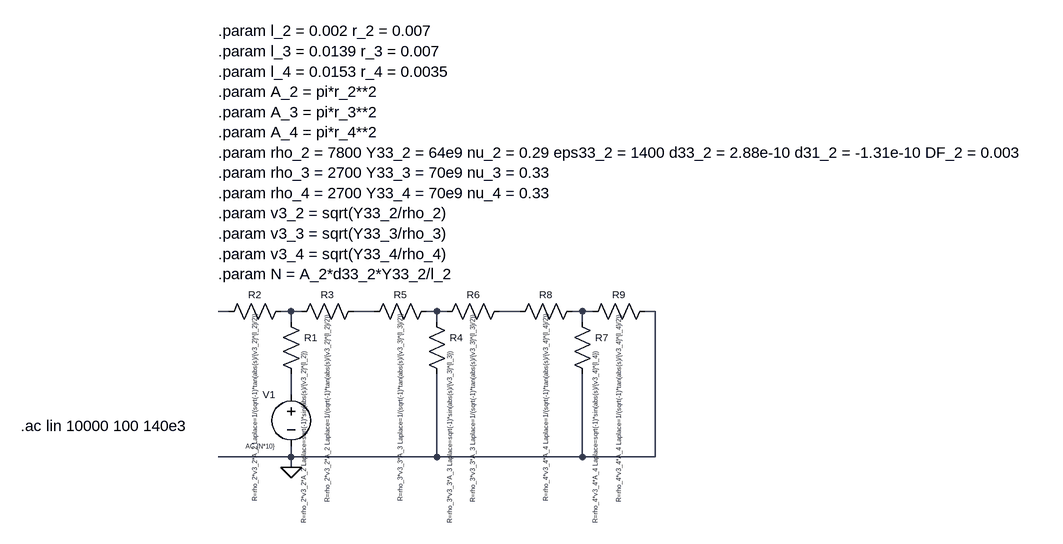
[diagram p0: schematic 230126 -Stepped-horn.asc]
230126 -Stepped-horn.asc, the LTspice schematic file:
Version 4
SHEET 1 1556 680
WIRE 80 144 64 144
WIRE 176 144 160 144
WIRE 192 144 176 144
WIRE 304 144 272 144
WIRE 400 144 384 144
WIRE 416 144 400 144
WIRE 528 144 496 144
WIRE 624 144 608 144
WIRE 640 144 624 144
WIRE 736 144 720 144
WIRE 176 160 176 144
WIRE 400 160 400 144
WIRE 624 160 624 144
WIRE 176 272 176 240
WIRE 176 368 176 352
WIRE 176 368 64 368
WIRE 400 368 400 240
WIRE 400 368 176 368
WIRE 624 368 624 240
WIRE 624 368 400 368
WIRE 736 368 736 144
WIRE 736 368 624 368
WIRE 176 384 176 368
FLAG 176 384 0
SYMBOL res 160 144 R0
WINDOW 0 36 40 Left 1
WINDOW 3 36 56 VRight 0
SYMATTR InstName R1
SYMATTR Value R=rho_2*v3_2*A_2 Laplace=sqrt(-1)*sin(abs(s)/{v3_2}*{l_2})
SYMBOL res 176 128 R90
WINDOW 0 0 56 VBottom 1
WINDOW 3 14 56 Left 0
SYMATTR InstName R2
SYMATTR Value R=rho_2*v3_2*A_2 Laplace=1/(sqrt(-1)*tan(abs(s)/{v3_2}*{l_2}/2))
SYMBOL res 176 160 R270
WINDOW 0 32 56 VTop 1
WINDOW 3 17 56 Right 0
SYMATTR InstName R3
SYMATTR Value R=rho_2*v3_2*A_2 Laplace=1/(sqrt(-1)*tan(abs(s)/{v3_2}*{l_2}/2))
SYMBOL res 384 144 R0
WINDOW 0 36 40 Left 1
WINDOW 3 36 56 VRight 0
SYMATTR InstName R4
SYMATTR Value R=rho_3*v3_3*A_3 Laplace=sqrt(-1)*sin(abs(s)/{v3_3}*{l_3})
SYMBOL res 400 128 R90
WINDOW 0 0 56 VBottom 1
WINDOW 3 14 56 Left 0
SYMATTR InstName R5
SYMATTR Value R=rho_3*v3_3*A_3 Laplace=1/(sqrt(-1)*tan(abs(s)/{v3_3}*{l_3}/2))
SYMBOL res 400 160 R270
WINDOW 0 32 56 VTop 1
WINDOW 3 17 56 Right 0
SYMATTR InstName R6
SYMATTR Value R=rho_3*v3_3*A_3 Laplace=1/(sqrt(-1)*tan(abs(s)/{v3_3}*{l_3}/2))
SYMBOL res 608 144 R0
WINDOW 0 36 40 Left 1
WINDOW 3 36 56 VRight 0
SYMATTR InstName R7
SYMATTR Value R=rho_4*v3_4*A_4 Laplace=sqrt(-1)*sin(abs(s)/{v3_4}*{l_4})
SYMBOL res 624 128 R90
WINDOW 0 0 56 VBottom 1
WINDOW 3 14 56 Left 0
SYMATTR InstName R8
SYMATTR Value R=rho_4*v3_4*A_4 Laplace=1/(sqrt(-1)*tan(abs(s)/{v3_4}*{l_4}/2))
SYMBOL res 624 160 R270
WINDOW 0 32 56 VTop 1
WINDOW 3 17 56 Right 0
SYMATTR InstName R9
SYMATTR Value R=rho_4*v3_4*A_4 Laplace=1/(sqrt(-1)*tan(abs(s)/{v3_4}*{l_4}/2))
SYMBOL voltage 176 256 M0
WINDOW 0 24 16 Left 1
WINDOW 3 24 96 Left 0
SYMATTR InstName V1
SYMATTR Value AC {N*10}
TEXT 64 -288 Left 2 !.param l_2 = 0.002 r_2 = 0.007\n.param l_3 = 0.0139 r_3 = 0.007\n.param l_4 = 0.0153 r_4 = 0.0035\n.param A_2 = pi*r_2**2\n.param A_3 = pi*r_3**2\n.param A_4 = pi*r_4**2\n.param rho_2 = 7800 Y33_2 = 64e9 nu_2 = 0.29 eps33_2 = 1400 d33_2 = 2.88e-10 d31_2 = -1.31e-10 DF_2 = 0.003 \n.param rho_3 = 2700 Y33_3 = 70e9 nu_3 = 0.33\n.param rho_4 = 2700 Y33_4 = 70e9 nu_4 = 0.33\n.param v3_2 = sqrt(Y33_2/rho_2)\n.param v3_3 = sqrt(Y33_3/rho_3)\n.param v3_4 = sqrt(Y33_4/rho_4)\n.param N = A_2*d33_2*Y33_2/l_2
TEXT -240 320 Left 2 !.ac lin 10000 100 140e3

The netlist it stands for:
* 230126 -Stepped-horn.asc
R1 N002 N007 R=rho_2*v3_2*A_2 Laplace=sqrt(-1)*sin(abs(s)/{v3_2}*{l_2})
R2 N002 N001 R=rho_2*v3_2*A_2 Laplace=1/(sqrt(-1)*tan(abs(s)/{v3_2}*{l_2}/2))
R3 N002 N003 R=rho_2*v3_2*A_2 Laplace=1/(sqrt(-1)*tan(abs(s)/{v3_2}*{l_2}/2))
R4 N004 0 R=rho_3*v3_3*A_3 Laplace=sqrt(-1)*sin(abs(s)/{v3_3}*{l_3})
R5 N004 N003 R=rho_3*v3_3*A_3 Laplace=1/(sqrt(-1)*tan(abs(s)/{v3_3}*{l_3}/2))
R6 N004 N005 R=rho_3*v3_3*A_3 Laplace=1/(sqrt(-1)*tan(abs(s)/{v3_3}*{l_3}/2))
R7 N006 0 R=rho_4*v3_4*A_4 Laplace=sqrt(-1)*sin(abs(s)/{v3_4}*{l_4})
R8 N006 N005 R=rho_4*v3_4*A_4 Laplace=1/(sqrt(-1)*tan(abs(s)/{v3_4}*{l_4}/2))
R9 N006 0 R=rho_4*v3_4*A_4 Laplace=1/(sqrt(-1)*tan(abs(s)/{v3_4}*{l_4}/2))
V1 N007 0 AC {N*10}
.param l_2 = 0.002 r_2 = 0.007
.param l_3 = 0.0139 r_3 = 0.007
.param l_4 = 0.0153 r_4 = 0.0035
.param A_2 = pi*r_2**2
.param A_3 = pi*r_3**2
.param A_4 = pi*r_4**2
.param rho_2 = 7800 Y33_2 = 64e9 nu_2 = 0.29 eps33_2 = 1400 d33_2 = 2.88e-10 d31_2 = -1.31e-10 DF_2 = 0.003
.param rho_3 = 2700 Y33_3 = 70e9 nu_3 = 0.33
.param rho_4 = 2700 Y33_4 = 70e9 nu_4 = 0.33
.param v3_2 = sqrt(Y33_2/rho_2)
.param v3_3 = sqrt(Y33_3/rho_3)
.param v3_4 = sqrt(Y33_4/rho_4)
.param N = A_2*d33_2*Y33_2/l_2
.ac lin 10000 100 140e3
.backanno
.end